# Altium project Charger Board.PrjPcb (part 2 of 3)

## Sheet uController.SchDoc
size A3
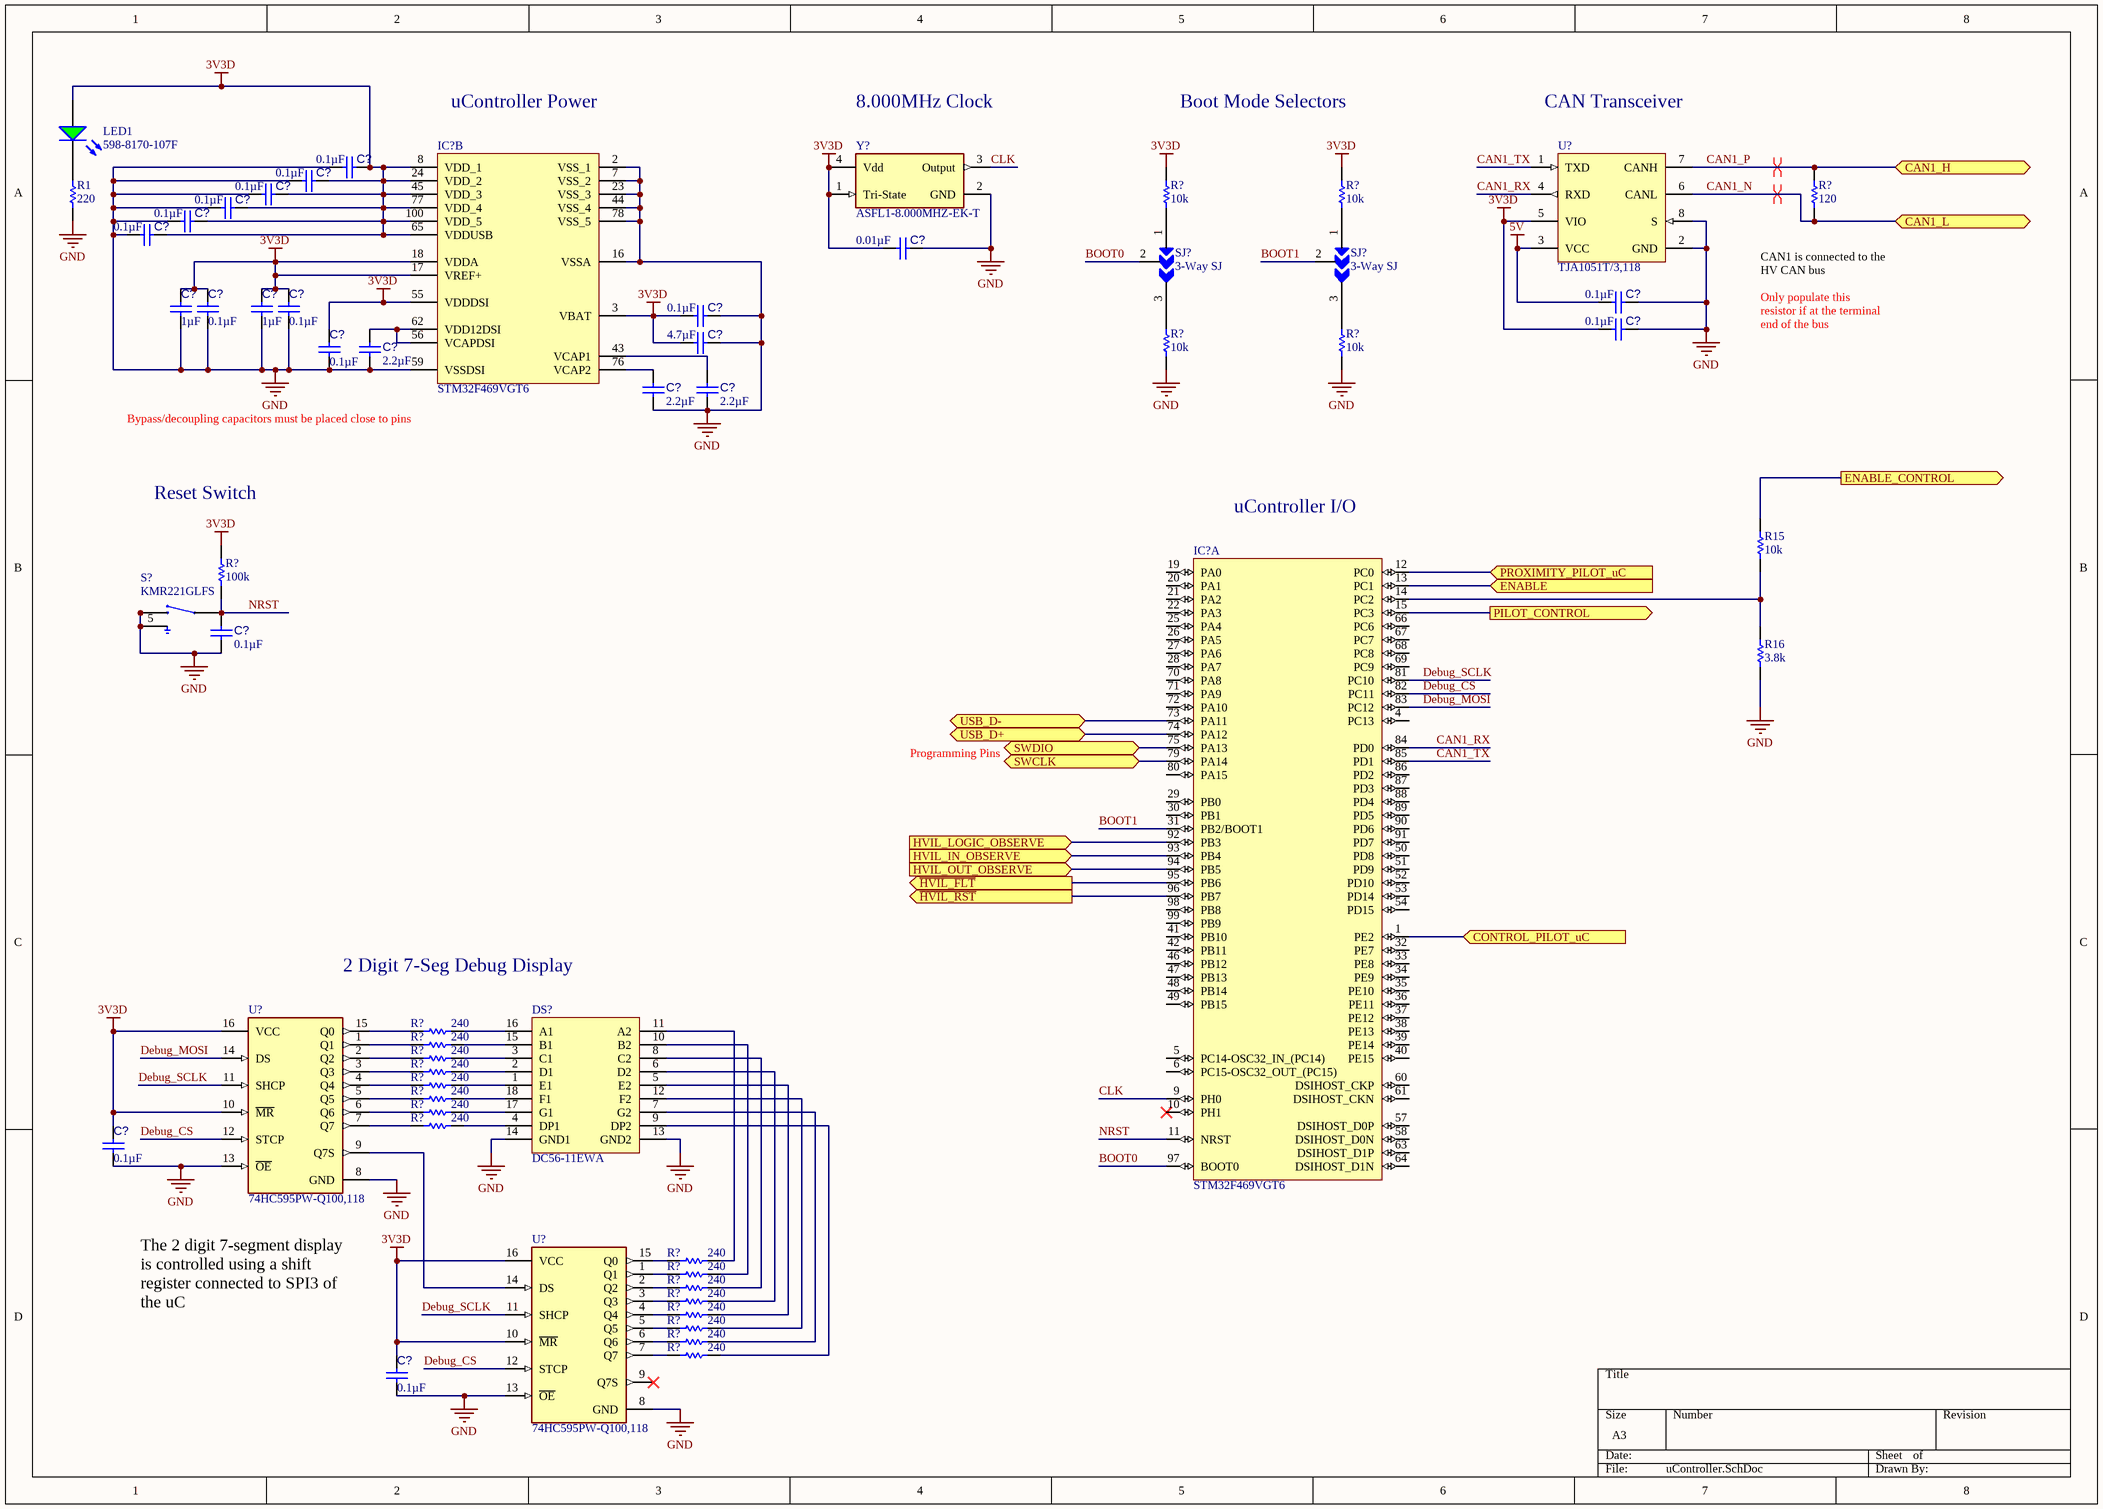
[diagram p2: uController.SchDoc]

### Parts
(Parts that share a designator on the sheet are numbered #1, #2 ... from top to bottom, then left to right.)
C?#3  0.1µF  [CAPC2013X145X50ML20T25]
C?#4  0.1µF  [CAPC2013X145X50ML20T25]
C?#5  0.1µF  [CAPC2013X145X50ML20T25]
C?#6  0.1µF  [CAPC2013X145X50ML20T25]
C?#7  0.1µF  [CAPC2013X145X50ML20T25]
C?#8  0.1µF  [CAPC2013X145X50ML20T25]
C?#9  0.01µF  [CAPC2013X145X50ML20T25]
C?#10  0.1µF  [CAPC2013X145X50ML20T25]
C?#11  0.1µF  [CAPC2013X145X50ML20T25]
C?#12  0.1µF  [CAPC2013X145X50ML20T25]
C?#13  0.1µF  [CAPC2013X145X50ML20T25]
C?#14  1µF  [CAPC2013X145X50ML20T25]
C?#15  1µF  [CAPC2013X145X50ML20T25]
C?#16  0.1µF  [CAPC2013X145X50ML20T25]
C?#17  0.1µF  [CAPC2013X145X50ML20T25]
C?#18  4.7µF  [CAPC2013X145X50ML20T25]
C?#19  2.2µF  [CAPC2013X145X50ML20T25]
C?#20  2.2µF  [CAPC2013X145X50ML20T25]
C?#21  2.2µF  [CAPC2013X145X50ML20T25]
C?#22  0.1µF  [CAPC2013X145X50ML20T25]
C?#23  0.1µF  [CAPC2013X145X50ML20T25]
C?#24  0.1µF  [CAPC2013X145X50ML20T25]
DS?#2  DC56-11EWA  [DIPS1524W75P254L2500H825Q18N]
IC?#1  STM32F469VGT6  [QFP50P1600X1600X160-100N]  (part B of 2)
IC?#2  STM32F469VGT6  [QFP50P1600X1600X160-100N]  (part A of 2)
LED1  598-8170-107F  [0805_A]
R1  220  [RESC2013X50X35ML15T15]
R15  10k  [RESC2013X50X35ML15T15]
R16  3.8k  [RESC2013X50X35ML15T15]
R?#5  10k  [RESC2013X50X35ML15T15]
R?#6  10k  [RESC2013X50X35ML15T15]
R?#7  120  [RESC2013X50X35ML15T15]
R?#8  10k  [RESC2013X50X35ML15T15]
R?#9  10k  [RESC2013X50X35ML15T15]
R?#10  100k  [RESC2013X50X35ML15T15]
R?#11  240  [RESC2013X50X35ML15T15]
R?#12  240  [RESC2013X50X35ML15T15]
R?#13  240  [RESC2013X50X35ML15T15]
R?#14  240  [RESC2013X50X35ML15T15]
R?#15  240  [RESC2013X50X35ML15T15]
R?#16  240  [RESC2013X50X35ML15T15]
R?#17  240  [RESC2013X50X35ML15T15]
R?#18  240  [RESC2013X50X35ML15T15]
R?#19  240  [RESC2013X50X35ML15T15]
R?#20  240  [RESC2013X50X35ML15T15]
R?#21  240  [RESC2013X50X35ML15T15]
R?#22  240  [RESC2013X50X35ML15T15]
R?#23  240  [RESC2013X50X35ML15T15]
R?#24  240  [RESC2013X50X35ML15T15]
R?#25  240  [RESC2013X50X35ML15T15]
R?#26  240  [RESC2013X50X35ML15T15]
S?  KMR221GLFS  [SW_KMR221GLFS]
SJ?#2  3-Way SJ  [3-Way SJ]
SJ?#3  3-Way SJ  [3-Way SJ]
U?#1  TJA1051T/3,118  [NXP-SOIC-8_L]
U?#2  74HC595PW-Q100,118  [FP-SOT403-1-MFG]
U?#3  74HC595PW-Q100,118  [FP-SOT403-1-MFG]
Y?  ASFL1-8.000MHZ-EK-T  [FP-ASFL1-MFG]

### Ports
CAN1_H (bidir), CAN1_L (bidir), CONTROL_PILOT_uC (in), ENABLE (in), ENABLE_CONTROL (out), HVIL_IN_OBSERVE (in), HVIL_LOGIC_OBSERVE (in), HVIL_OUT_OBSERVE (in), PILOT_CONTROL (out), PROXIMITY_PILOT_uC (in), SWCLK (bidir), SWDIO (bidir), USB_D+ (bidir), USB_D- (bidir), ~{HVIL_FLT} (out), ~{HVIL_RST} (out)

### Nets
3V3D: C?#3.2 C?#4.2 C?#5.2 C?#6.2 C?#7.2 C?#8.2 C?#9.1 C?#10.1 C?#11.1 C?#13.1 C?#14.2 C?#15.2 C?#16.1 C?#17.1 C?#18.1 C?#23.1 C?#24.1 IC?#1.3(VBAT) IC?#1.8(VDD_1) IC?#1.17(VREF+) IC?#1.18(VDDA) IC?#1.24(VDD_2) IC?#1.45(VDD_3) IC?#1.55(VDDDSI) IC?#1.65(VDDUSB) IC?#1.77(VDD_4) IC?#1.100(VDD_5) LED1.2(A) R?#5.2 R?#6.2 R?#10.2 U?#1.5(VIO) U?#2.10(~{MR}) U?#2.16(VCC) U?#3.10(~{MR}) U?#3.16(VCC) Y?.1(Tri-State) Y?.4(Vdd)
5V: C?#12.1 U?#1.3(VCC)
GND: C?#3.1 C?#4.1 C?#5.1 C?#6.1 C?#7.1 C?#8.1 C?#9.2 C?#10.2 C?#11.2 C?#12.2 C?#13.2 C?#14.1 C?#15.1 C?#16.2 C?#17.2 C?#18.2 C?#19.1 C?#20.1 C?#21.1 C?#22.1 C?#23.2 C?#24.2 DS?#2.13(GND2) DS?#2.14(GND1) IC?#1.2(VSS_1) IC?#1.7(VSS_2) IC?#1.16(VSSA) IC?#1.23(VSS_3) IC?#1.44(VSS_4) IC?#1.59(VSSDSI) IC?#1.78(VSS_5) R1.2 R16.1 R?#8.1 R?#9.1 S?.2 S?.3 S?.5 U?#1.2(GND) U?#1.8(S) U?#2.8(GND) U?#2.13(~{OE}) U?#3.8(GND) U?#3.13(~{OE}) Y?.2(GND)
BOOT0: IC?#2.97(BOOT0) SJ?#2.2
BOOT1: IC?#2.31(PB2/BOOT1) SJ?#3.2
CAN1_N: R?#7.1 U?#1.6(CANL) ; port CAN1_L
CAN1_P: R?#7.2 U?#1.7(CANH) ; port CAN1_H
CAN1_RX: IC?#2.84(PD0) U?#1.4(RXD)
CAN1_TX: IC?#2.85(PD1) U?#1.1(TXD)
CLK: IC?#2.9(PH0) Y?.3(Output)
Debug_CS: IC?#2.82(PC11) U?#2.12(STCP) U?#3.12(STCP)
Debug_MOSI: IC?#2.83(PC12) U?#2.14(DS)
Debug_SCLK: IC?#2.81(PC10) U?#2.11(SHCP) U?#3.11(SHCP)
NRST: C?#22.2 IC?#2.11(NRST) R?#10.1 S?.1 S?.4
NetC?#19_2: C?#19.2 IC?#1.56(VCAPDSI) IC?#1.62(VDD12DSI)
NetC?#20_2: C?#20.2 IC?#1.76(VCAP2)
NetC?#21_2: C?#21.2 IC?#1.43(VCAP1)
NetDS?#2_1: DS?#2.1(E1) R?#15.1
NetDS?#2_2: DS?#2.2(D1) R?#14.1
NetDS?#2_3: DS?#2.3(C1) R?#13.1
NetDS?#2_4: DS?#2.4(DP1) R?#18.1
NetDS?#2_5: DS?#2.5(E2) R?#23.1
NetDS?#2_6: DS?#2.6(D2) R?#22.1
NetDS?#2_7: DS?#2.7(G2) R?#25.1
NetDS?#2_8: DS?#2.8(C2) R?#21.1
NetDS?#2_9: DS?#2.9(DP2) R?#26.1
NetDS?#2_10: DS?#2.10(B2) R?#20.1
NetDS?#2_11: DS?#2.11(A2) R?#19.1
NetDS?#2_12: DS?#2.12(F2) R?#24.1
NetDS?#2_15: DS?#2.15(B1) R?#12.1
NetDS?#2_16: DS?#2.16(A1) R?#11.1
NetDS?#2_17: DS?#2.17(G1) R?#17.1
NetDS?#2_18: DS?#2.18(F1) R?#16.1
NetIC?#2_1: IC?#2.1(PE2) ; port CONTROL_PILOT_uC
NetIC?#2_12: IC?#2.12(PC0) ; port PROXIMITY_PILOT_uC
NetIC?#2_13: IC?#2.13(PC1) ; port ENABLE
NetIC?#2_14: IC?#2.14(PC2) R15.1 R16.2
NetIC?#2_15: IC?#2.15(PC3) ; port PILOT_CONTROL
NetIC?#2_73: IC?#2.73(PA11) ; port USB_D-
NetIC?#2_74: IC?#2.74(PA12) ; port USB_D+
NetIC?#2_75: IC?#2.75(PA13) ; port SWDIO
NetIC?#2_79: IC?#2.79(PA14) ; port SWCLK
NetIC?#2_92: IC?#2.92(PB3) ; port HVIL_LOGIC_OBSERVE
NetIC?#2_93: IC?#2.93(PB4) ; port HVIL_IN_OBSERVE
NetIC?#2_94: IC?#2.94(PB5) ; port HVIL_OUT_OBSERVE
NetIC?#2_95: IC?#2.95(PB6) ; port ~{HVIL_FLT}
NetIC?#2_96: IC?#2.96(PB7) ; port ~{HVIL_RST}
NetLED1_1: LED1.1(K) R1.1
NetR5_1: R15.2 ; port ENABLE_CONTROL
NetR?#5_1: R?#5.1 SJ?#2.1
NetR?#6_1: R?#6.1 SJ?#3.1
NetR?#8_2: R?#8.2 SJ?#2.3
NetR?#9_2: R?#9.2 SJ?#3.3
NetR?#11_2: R?#11.2 U?#2.15(Q0)
NetR?#12_2: R?#12.2 U?#2.1(Q1)
NetR?#13_2: R?#13.2 U?#2.2(Q2)
NetR?#14_2: R?#14.2 U?#2.3(Q3)
NetR?#15_2: R?#15.2 U?#2.4(Q4)
NetR?#16_2: R?#16.2 U?#2.5(Q5)
NetR?#17_2: R?#17.2 U?#2.6(Q6)
NetR?#18_2: R?#18.2 U?#2.7(Q7)
NetR?#19_2: R?#19.2 U?#3.15(Q0)
NetR?#20_2: R?#20.2 U?#3.1(Q1)
NetR?#21_2: R?#21.2 U?#3.2(Q2)
NetR?#22_2: R?#22.2 U?#3.3(Q3)
NetR?#23_2: R?#23.2 U?#3.4(Q4)
NetR?#24_2: R?#24.2 U?#3.5(Q5)
NetR?#25_2: R?#25.2 U?#3.6(Q6)
NetR?#26_2: R?#26.2 U?#3.7(Q7)
NetU?#2_9: U?#2.9(Q7S) U?#3.14(DS)

Not connected (* = marked no-connect by the designer): IC?#2 4(PC13) 5(PC14-OSC32_IN_(PC14)) 6(PC15-OSC32_OUT_(PC15)) 10(PH1)* 19(PA0) 20(PA1) 21(PA2) 22(PA3) 25(PA4) 26(PA5) 27(PA6) 28(PA7) 29(PB0) 30(PB1) 32(PE7) 33(PE8) 34(PE9) 35(PE10) 36(PE11) 37(PE12) 38(PE13) 39(PE14) 40(PE15) 41(PB10) 42(PB11) 46(PB12) 47(PB13) 48(PB14) 49(PB15) 50(PD8) 51(PD9) 52(PD10) 53(PD14) 54(PD15) 57(DSIHOST_D0P) 58(DSIHOST_D0N) 60(DSIHOST_CKP) 61(DSIHOST_CKN) 63(DSIHOST_D1P) 64(DSIHOST_D1N) 66(PC6) 67(PC7) 68(PC8) 69(PC9) 70(PA8) 71(PA9) 72(PA10) 80(PA15) 86(PD2) 87(PD3) 88(PD4) 89(PD5) 90(PD6) 91(PD7) 98(PB8) 99(PB9); U?#3 9(Q7S)*

### Layout directives
differential pair: CAN1_N, CAN1_P

### Notes on the sheet
- uController Power
- 8.000MHz Clock
- Boot Mode Selectors
- CAN Transceiver
- (near R?#7) CAN1 is connected to the HV CAN bus
- Only populate this resistor if at the terminal end of the bus
- Bypass/decoupling capacitors must be placed close to pins
- Reset Switch
- uController I/O
- Programming Pins
- 2 Digit 7-Seg Debug Display
- The 2 digit 7-segment display is controlled using a shift register connected to SPI3 of the uC

### Library data of the parts
C?#3-C?#8 C?#10-C?#13 C?#16 C?#17 C?#22-C?#24 = CMP-001-00010-4: Chip Capacitor, 0.1 uF, +/-10%, 25 V, 0805 (2012 Metric); Manufacturer: KEMET; Manufacturer Part Number: C0805C104K3RACTU; Dielectric Material: Ceramic; Tolerance: 10%; Capacitance: 100nF; Dielectric: X7R; Voltage: 25V; Value: 0.1µF; Supplier 1: Digi-Key; Supplier Part Number 1: 399-1168-1-ND; RoHS: Yes; Category: Ceramic Capacitors; Stock 1: 417116; Pricing 1: 1=0.14000, 10=0.10000, 50=0.05660, 100=0.04680, 500=0.03284, 1000=0.02719 (USD); Mount: Surface Mount; Case/Package: 0805; Min Operating Temperature: -55°C; Max Operating Temperature: 125°C; Packaging: Tape and Reel; Termination: SMD/SMT; Length: 2mm; Height: 0.9mm; Depth: 1.25mm; Radiation Hardening: No; ComponentLink1URL: https://datasheet.ciiva.com/18193/getdatasheetpartid-385649-18193413.pdf?src-supplier=Verical; ComponentLink1Description: https://datasheet.ciiva.com/18193/getdatasheetpartid-385649-18193413.pdf?src-supplier=Verical; ComponentLink2URL: https://datasheet.ciiva.com/7842/kem-c1002-x7r-smd-7842536.pdf?src-supplier=Element14; ComponentLink2Description: https://datasheet.ciiva.com/7842/kem-c1002-x7r-smd-7842536.pdf?src-supplier=Element14; ComponentLink3URL: https://datasheet.ciiva.com/7842/kem-c1002-x7r-smd-7842538.pdf?src-supplier=Element14; ComponentLink3Description: https://datasheet.ciiva.com/7842/kem-c1002-x7r-smd-7842538.pdf?src-supplier=Element14
C?#9 = CMP-001-00010-4: Chip Capacitor, 0.01 uF, +/-10%, 25 V, 0805 (2012 Metric); Manufacturer: KEMET; Manufacturer Part Number: C0805C103K3RACTU; Dielectric Material: Ceramic; Capacitance: 10nF; Voltage Rating: 25V; Tolerance: 10%; Dielectric: X7R; Dissipation Factor: 3.5%; Value: 0.01µF; Supplier 1: Digi-Key; Supplier Part Number 1: 399-7994-1-ND; RoHS: Yes; Category: Ceramic Capacitors; Stock 1: 50651; Pricing 1: 1=0.15000, 10=0.11000, 50=0.06220, 100=0.05160, 500=0.03616, 1000=0.02994 (USD); Mount: Surface Mount; Case/Package: 0805; Case Code (Metric): 2012; Case Code (Imperial): 0805; Min Operating Temperature: -55°C; Max Operating Temperature: 125°C; Package Quantity: 1; Packaging: Tape and Reel; Voltage Rating (DC): 25V; Termination: SMD/SMT; Length: 2mm; Height: 0.78mm; Lead Pitch: 0.75mm; Width: 0.049inch; Thickness: 0.035inch; Depth: 1.25mm; Radiation Hardening: No; REACH SVHC: No SVHC; ComponentLink1URL: http://www.jameco.com/Jameco/Products/ProdDS/1637716.pdf?src-supplier=Jameco; ComponentLink1Description: http://www.jameco.com/Jameco/Products/ProdDS/1637716.pdf?src-supplier=Jameco; ComponentLink2URL: http://www.farnell.com/datasheets/2746089.pdf?src-supplier=Farnell; ComponentLink2Description: http://www.farnell.com/datasheets/2746089.pdf?src-supplier=Farnell; ComponentLink3URL: https://www.verical.com/server-webapp/html/getDatasheet?partID=697850&src-supplier=Verical; ComponentLink3Description: https://www.verical.com/server-webapp/html/getDatasheet?partID=697850&src-supplier=Verical; ComponentLink4URL: http://components.arrow.com/part/dataview/0323_00325063?src-supplier=Arrow+Europe; ComponentLink4Description: http://components.arrow.com/part/dataview/0323_00325063?src-supplier=Arrow+Europe; ComponentLink5URL: http://www.farnell.com/datasheets/2315422.pdf?src-supplier=Farnell; ComponentLink5Description: http://www.farnell.com/datasheets/2315422.pdf?src-supplier=Farnell; ComponentLink6URL: http://www.mouser.com/ds/2/212/KEM_C1002_X7R_SMD-1102033.pdf?src-supplier=Mouser; ComponentLink6Description: http://www.mouser.com/ds/2/212/KEM_C1002_X7R_SMD-1102033.pdf?src-supplier=Mouser; ComponentLink7URL: http://components.arrow.com/part/dataview/2091057S98063N7429?src-supplier=Arrow+Electronics; ComponentLink7Description: http://components.arrow.com/part/dataview/2091057S98063N7429?src-supplier=Arrow+Electronics; ComponentLink8URL: https://api.kemet.com/component-edge/download/datasheet/C0805C103K3RACTU.pdf?src-supplier=Digi-Key; ComponentLink8Description: https://api.kemet.com/component-edge/download/datasheet/C0805C103K3RACTU.pdf?src-supplier=Digi-Key; ComponentLink9URL: http://capacitoredge.kemet.com/capedge2/DataSheet?pn=C0805C103K3RACTU&src-supplier=Avnet; ComponentLink9Description: http://capacitoredge.kemet.com/capedge2/DataSheet?pn=C0805C103K3RACTU&src-supplier=Avnet; ComponentLink10URL: https://search.kemet.com/component-edge/download/datasheet/C0805C103K3RACTU.pdf?src-supplier=Digi-Key; ComponentLink10Description: https://search.kemet.com/component-edge/download/datasheet/C0805C103K3RACTU.pdf?src-supplier=Digi-Key; ComponentLink11URL: http://www.farnell.com/datasheets/2746089.pdf?src-supplier=Newark; ComponentLink11Description: http://www.farnell.com/datasheets/2746089.pdf?src-supplier=Newark; ComponentLink12URL: http://www.farnell.com/datasheets/2064982.pdf?src-supplier=Element14; ComponentLink12Description: http://www.farnell.com/datasheets/2064982.pdf?src-supplier=Element14
C?#14 C?#15 = CMP-001-00010-4: Chip Capacitor, 1 uF, +/-10%, 25 V, 0805 (2012 Metric); Manufacturer: KEMET; Manufacturer Part Number: C0805C105K3RACTU; Dielectric Material: Ceramic; Capacitance: 1uF; Tolerance: 10%; Dielectric: X7R; Voltage: 25V; Value: 1µF; Supplier 1: Digi-Key; Supplier Part Number 1: 399-8004-1-ND; RoHS: Yes; Category: Ceramic Capacitors; Stock 1: 360844; Pricing 1: 1=0.14000, 10=0.10100, 50=0.05720, 100=0.04740, 500=0.03322, 1000=0.02750 (USD); Mount: Surface Mount; Case/Package: 0805; Number of Pins: 2; Contact Plating: Tin,Matte; Case Code (Imperial): 0805; Case Code (Metric): 2012; Min Operating Temperature: -55°C; Max Operating Temperature: 125°C; Packaging: Tape and Reel; Termination: SMD/SMT; Package Quantity: 1; Voltage Rating: 25V; Voltage Rating (DC): 25V; Length: 2mm; Height: 1.25mm; Depth: 1.25mm; Width: 0.049inch; Thickness: 0.055inch; Radiation Hardening: No; REACH SVHC: No SVHC; ComponentLink1URL: https://datasheet.ciiva.com/6074/kem-c1002-x7r-smd-6074661.pdf?src-supplier=Farnell; ComponentLink1Description: https://datasheet.ciiva.com/6074/kem-c1002-x7r-smd-6074661.pdf?src-supplier=Farnell; ComponentLink2URL: https://datasheet.ciiva.com/28610/1918693-28610874.pdf?src-supplier=Element14; ComponentLink2Description: https://datasheet.ciiva.com/28610/1918693-28610874.pdf?src-supplier=Element14
C?#18 = CMP-001-00010-4: Chip Capacitor, 4.7 uF, +/-10%, 25 V, 0805 (2012 Metric); Manufacturer: KEMET; Manufacturer Part Number: C0805C475K3PACTU; Dielectric Material: Ceramic; Capacitance: 4.7uF; Tolerance: 10%; Dielectric: X5R; Voltage: 25V; Value: 4.7µF; Supplier 1: Digi-Key; Supplier Part Number 1: 399-5505-1-ND; RoHS: Yes; Category: Ceramic Capacitors; Stock 1: 643803; Pricing 1: 1=0.33000, 10=0.22700, 50=0.15880, 100=0.13610, 500=0.10210, 1000=0.08621 (USD); Mount: Surface Mount; Case/Package: 0805; Number of Pins: 2; Min Operating Temperature: -55°C; Max Operating Temperature: 85°C; Packaging: Tape and Reel; Termination: SMD/SMT; Voltage Rating (DC): 25V; Length: 2mm; Height: 1.25mm; Depth: 1.25mm; Radiation Hardening: No; Lead Free: Lead Free; ComponentLink1URL: https://datasheet.ciiva.com/22748/1918694-22748309.pdf?src-supplier=Element14; ComponentLink1Description: https://datasheet.ciiva.com/22748/1918694-22748309.pdf?src-supplier=Element14; ComponentLink2URL: https://datasheet.ciiva.com/7842/40889-7842614.pdf?src-supplier=Element14; ComponentLink2Description: https://datasheet.ciiva.com/7842/40889-7842614.pdf?src-supplier=Element14; ComponentLink3URL: https://datasheet.ciiva.com/18193/getdatasheetpartid-385757-18193895.pdf?src-supplier=Verical; ComponentLink3Description: https://datasheet.ciiva.com/18193/getdatasheetpartid-385757-18193895.pdf?src-supplier=Verical; ComponentLink4URL: https://datasheet.ciiva.com/18193/getdatasheetpartid-195812-18193898.pdf?src-supplier=Verical; ComponentLink4Description: https://datasheet.ciiva.com/18193/getdatasheetpartid-195812-18193898.pdf?src-supplier=Verical
C?#19-C?#21 = CMP-001-00010-4: Chip Capacitor, 2.2 uF, +/-10%, 25 V, 0805 (2012 Metric); Manufacturer: KEMET; Manufacturer Part Number: C0805C225K3RACTU; Dielectric Material: Ceramic; Capacitance: 2.2uF; Tolerance: 10%; Dielectric: X7R; Voltage Rating (DC): 25V; Value: 2.2µF; Supplier 1: Digi-Key; Supplier Part Number 1: 399-11941-1-ND; RoHS: Yes; Category: Ceramic Capacitors; Stock 1: 55952; Pricing 1: 1=0.28000, 10=0.19300, 50=0.11600, 100=0.09790, 500=0.06700, 1000=0.05928 (USD); Mount: Surface Mount; Case/Package: 0805; Case Code (Imperial): 0805; Case Code (Metric): 2012; Min Operating Temperature: -55°C; Max Operating Temperature: 125°C; Packaging: Cut Tape; Voltage: 25V; Termination: Solder; Dissipation Factor: 10%; Voltage Rating: 25V; Length: 0.079inch; Height: 1.25mm; Depth: 1.25mm; Width: 0.049inch; Thickness: 0.055inch; REACH SVHC: No SVHC; ComponentLink1URL: http://www.mouser.com/ds/2/212/KEM_C1002_X7R_SMD-1102033.pdf?src-supplier=Mouser; ComponentLink1Description: http://www.mouser.com/ds/2/212/KEM_C1002_X7R_SMD-1102033.pdf?src-supplier=Mouser; ComponentLink2URL: http://www.farnell.com/datasheets/2741187.pdf?src-supplier=Farnell; ComponentLink2Description: http://www.farnell.com/datasheets/2741187.pdf?src-supplier=Farnell; ComponentLink3URL: http://www.alliedelec.com/m/d/51f554c3dd800f51434b811e71a34895.pdf?src-supplier=Allied+Electronics; ComponentLink3Description: http://www.alliedelec.com/m/d/51f554c3dd800f51434b811e71a34895.pdf?src-supplier=Allied+Electronics; ComponentLink4URL: http://www.kemet.com/docfinder?Partnumber=C0805C225K3RAC7800&src-supplier=Digi-Key; ComponentLink4Description: http://www.kemet.com/docfinder?Partnumber=C0805C225K3RAC7800&src-supplier=Digi-Key; ComponentLink5URL: http://www.kemet.com/Lists/ProductCatalog/Attachments/53/KEM_C1002_X7R_SMD.pdf?src-supplier=Avnet; ComponentLink5Description: http://www.kemet.com/Lists/ProductCatalog/Attachments/53/KEM_C1002_X7R_SMD.pdf?src-supplier=Avnet; ComponentLink6URL: https://api.kemet.com/component-edge/download/datasheet/C0805C225K3RAC7800.pdf?src-supplier=Digi-Key; ComponentLink6Description: https://api.kemet.com/component-edge/download/datasheet/C0805C225K3RAC7800.pdf?src-supplier=Digi-Key; ComponentLink7URL: http://www.farnell.com/datasheets/2112056.pdf?src-supplier=Element14; ComponentLink7Description: http://www.farnell.com/datasheets/2112056.pdf?src-supplier=Element14; ComponentLink8URL: http://www.farnell.com/datasheets/2741187.pdf?src-supplier=Newark; ComponentLink8Description: http://www.farnell.com/datasheets/2741187.pdf?src-supplier=Newark
DS?#2 = DC56-11EWA: Display; Manufacturer_Name: Kingbright; Datasheet Link: http://www.us.kingbright.com/images/catalog/SPEC/DC56-11EWA.pdf; Height: 8.25mm; Manufacturer_Part_Number: DC56-11EWA; Arrow Part Number: DC56-11EWA; Arrow Price/Stock: https://www.arrow.com/en/products/dc56-11ewa/kingbright; Mouser Part Number: 604-DC56-11EWA; Mouser Price/Stock: https://www.mouser.co.uk/ProductDetail/Kingbright/DC56-11EWA?qs=SO8VdE%2FgosGvL%2FnJcFkMow%3D%3D
IC?#1 IC?#2 = STM32F469VGT6: Integrated Circuit; Manufacturer_Name: STMicroelectronics; Datasheet Link: http://www.mouser.com/datasheet/2/389/stm32f469ae-956306.pdf; Height: 1.6mm; Manufacturer_Part_Number: STM32F469VGT6; Arrow Part Number: STM32F469VGT6; Arrow Price/Stock: https://www.arrow.com/en/products/stm32f469vgt6/stmicroelectronics; Mouser Part Number: 511-STM32F469VGT6; Mouser Price/Stock: https://www.mouser.co.uk/ProductDetail/STMicroelectronics/STM32F469VGT6?qs=o7IDWEFmXKBnYVpbRx%2F38g%3D%3D
LED1 = CMP-2000-05655-1: Single Color, 2 V, -30 to 85 degC, 2-Pin SMD (0805), RoHS, Tape and Reel; Manufacturer: Dialight; Main Category: ChipLED; Shape Type: Rectangular; Forward Current: 25mA; Product Length (mm): 2mm; Emitting Color: YellowGreen; Test Current (It): 20mA; Number of  Elements: 1; Luminous Intensity: 20mcd; DELETED: Compliant; Reverse Voltage: 5V; Chip Material: GaP; High Brightness: No; Viewing Angle: 140deg; Dominant Wave Length: 570nm; Type: Uni-Color; Product Depth (mm): 1.25mm; Power Dissipation: 60W; Product Height (mm): 0.7mm; Forward Voltage: 2.4V; Lens Dimensions: 1.4x1.25x0.4mm; Pin Count: 2; Datasheet URL: https://datasheet.ciiva.com/22748/1484480-22748121.pdf; Operating Temperature Classification: Commercial; Package Reference: 0805; Operating Temp Range: -30Cto85C; Mounting: SurfaceMount; Mounting Technology: SurfaceMount; Manufacturer URL: http://www.dialight.com/; Package Description: 2-Pin Surface Mount Device, Body 2 x 1.25 mm; Lum Intensity: 20mcd; Datasheet Version: 10/2008; Rad Hardened: No; Packaging: TapeandReel; Package Type: SMD
R1 = CMP-009-00001-4: as R?#1 on sheet PartsTemplate; Value: 220
R15 R16 R?#5 R?#6 R?#8 R?#9 = CMP-009-00001-4: Chip Resistor, 10k Ohm, +/- 1%, 125 mW, -55 to 155 degC, 0805 (2012 Metric); Manufacturer: Yageo; Manufacturer Part Number: RC0805FR-0710KL; Resistance: 10kR; Temperature Coefficient: 100ppm/°C; Power Rating: 125mW; Voltage Rating: 150V; Supplier 1: Digi-Key; Supplier Part Number 1: 311-10.0KCRCT-ND; RoHS: Yes; Category: Chip SMD Resistors; Stock 1: 19063106; Pricing 1: 1=0.10000, 10=0.03900, 100=0.01570, 1000=0.00705, 2500=0.00612 (USD); Case/Package: 0805; Case Code (Imperial): 0805; Case Code (Metric): 2012; Min Operating Temperature: -55°C; Max Operating Temperature: 155°C; Packaging: Tape and Reel; Tolerance: 1%; Composition: Thick Film; Package Quantity: 1; Termination: SMD/SMT; Number of Terminations: 2; Military Standard: Not; Max Power Dissipation: 125mW; Features: Moisture Resistant; Length: 2mm; Height: 0.024inch; Width: 0.049inch; Depth: 1.25mm; REACH SVHC: Unknown; Lead Free: Lead Free; ComponentLink1URL: https://datasheet.ciiva.com/11808/0900766b8106beab-11808151.pdf?src-supplier=RSComponents; ComponentLink1Description: https://datasheet.ciiva.com/11808/0900766b8106beab-11808151.pdf?src-supplier=RSComponents; ComponentLink2URL: https://datasheet.ciiva.com/12669/rc0805-12669688.pdf?src-supplier=Mouser; ComponentLink2Description: https://datasheet.ciiva.com/12669/rc0805-12669688.pdf?src-supplier=Mouser; ComponentLink3URL: https://datasheet.ciiva.com/46447/444164-46447563.pdf?src-supplier=Element14; ComponentLink3Description: https://datasheet.ciiva.com/46447/444164-46447563.pdf?src-supplier=Element14; ComponentLink4URL: https://datasheet.ciiva.com/2456/pyu-r-int-thick-7-2456972.pdf?src-supplier=Digi-Key; ComponentLink4Description: https://datasheet.ciiva.com/2456/pyu-r-int-thick-7-2456972.pdf?src-supplier=Digi-Key; ComponentLink5URL: https://datasheet.ciiva.com/2456/pyu-r-int-thick-7-2456973.pdf?src-supplier=Digi-Key; ComponentLink5Description: https://datasheet.ciiva.com/2456/pyu-r-int-thick-7-2456973.pdf?src-supplier=Digi-Key; ComponentLink6URL: https://datasheet.ciiva.com/2456/pyu-r-int-thick-7-2456974.pdf?src-supplier=Digi-Key; ComponentLink6Description: https://datasheet.ciiva.com/2456/pyu-r-int-thick-7-2456974.pdf?src-supplier=Digi-Key; ComponentLink7URL: https://datasheet.ciiva.com/16747/rc0805-16747087.pdf?src-supplier=Future+Electronics; ComponentLink7Description: https://datasheet.ciiva.com/16747/rc0805-16747087.pdf?src-supplier=Future+Electronics
  R15 R?#5 R?#6 R?#8 R?#9: Value: 10k
  R16: Value: 3.8k
R?#7 = CMP-009-00001-4: Chip Resistor, 120 Ohm, +/- 1%, 125 mW, -55 to 155 degC, 0805 (2012 Metric); Manufacturer: TE Connectivity; Manufacturer Part Number: CRGCQ0805F120R; Resistance: 120R; Max Power Dissipation: 125mW; Temperature Coefficient: 100ppm/°C; Value: 120; Supplier 1: Digi-Key; Supplier Part Number 1: A129738CT-ND; Stock 1: 52253; Pricing 1: 1=0.10000, 10=0.04700, 100=0.01890, 1000=0.00851, 2500=0.00738 (USD); Case/Package: 0805; Case Code (Imperial): 0805; Case Code (Metric): 2012; Min Operating Temperature: -55°C; Max Operating Temperature: 155°C; Composition: Thick Film; Features: Moisture Resistant; Packaging: Tape and Reel; Tolerance: 1%; Number of Terminations: 2; ComponentLink1URL: https://www.te.com/commerce/DocumentDelivery/DDEController?Action=srchrtrv&amp;DocNm=1773204-3&amp;DocType=DS&amp;DocLang=English&src-supplier=Digi-Key; ComponentLink1Description: https://www.te.com/commerce/DocumentDelivery/DDEController?Action=srchrtrv&amp;DocNm=1773204-3&amp;DocType=DS&amp;DocLang=English&src-supplier=Digi-Key; ComponentLink2URL: https://4donline.ihs.com/images/VipMasterIC/IC/TYEL/TYEL-S-A0004929575/TYEL-S-A0004929575-1.pdf?hkey=52A5661711E402568146F3353EA87419&src-supplier=Element14; ComponentLink2Description: https://4donline.ihs.com/images/VipMasterIC/IC/TYEL/TYEL-S-A0004929575/TYEL-S-A0004929575-1.pdf?hkey=52A5661711E402568146F3353EA87419&src-supplier=Element14; ComponentLink3URL: https://4donline.ihs.com/images/VipMasterIC/IC/TYEL/TYEL-S-A0004929575/TYEL-S-A0004929575-1.pdf?hkey=52A5661711E402568146F3353EA87419&src-supplier=Newark; ComponentLink3Description: https://4donline.ihs.com/images/VipMasterIC/IC/TYEL/TYEL-S-A0004929575/TYEL-S-A0004929575-1.pdf?hkey=52A5661711E402568146F3353EA87419&src-supplier=Newark; ComponentLink4URL: https://4donline.ihs.com/images/VipMasterIC/IC/TYEL/TYEL-S-A0004929575/TYEL-S-A0004929575-1.pdf?hkey=52A5661711E402568146F3353EA87419&src-supplier=Farnell; ComponentLink4Description: https://4donline.ihs.com/images/VipMasterIC/IC/TYEL/TYEL-S-A0004929575/TYEL-S-A0004929575-1.pdf?hkey=52A5661711E402568146F3353EA87419&src-supplier=Farnell; ComponentLink5URL: http://datasheet.octopart.com/CRGCQ0805F120R-TE-Connectivity-datasheet-114679081.pdf?src-supplier=Master+Electronics; ComponentLink5Description: http://datasheet.octopart.com/CRGCQ0805F120R-TE-Connectivity-datasheet-114679081.pdf?src-supplier=Master+Electronics; ComponentLink6URL: http://sigma.octopart.com/114695583/technical_drawing/TE-Connectivity-CRGCQ0805F120R.pdf?src-supplier=Sager+Electronics; ComponentLink6Description: http://sigma.octopart.com/114695583/technical_drawing/TE-Connectivity-CRGCQ0805F120R.pdf?src-supplier=Sager+Electronics
R?#10 = CMP-009-00001-4: Chip Resistor, 100k Ohm, +/- 1%, 125 mW, -55 to 155 degC, 0805 (2012 Metric); Manufacturer: Yageo; Manufacturer Part Number: RC0805FR-07100KL; Resistance: 100kR; Voltage Rating (DC): 150V; Temperature Coefficient: 100ppm/°C; Power Rating: 125mW; Value: 100k; Supplier 1: Digi-Key; Supplier Part Number 1: 311-100KCRCT-ND; RoHS: Yes; Category: Chip SMD Resistors; Stock 1: 3716407; Pricing 1: 1=0.10000, 10=0.03900, 100=0.01570, 1000=0.00705, 2500=0.00612 (USD); Case/Package: 0805; Number of Pins: 2; Case Code (Metric): 2012; Case Code (Imperial): 0805; Min Operating Temperature: -55°C; Max Operating Temperature: 155°C; Tolerance: 1%; Packaging: Tape and Reel; Composition: Thick Film; Voltage Rating: 150V; Package Quantity: 1; Number of Terminations: 2; Termination: SMD/SMT; Military Standard: Not; Max Power Dissipation: 125mW; Features: Moisture Resistant; Length: 2mm; Height: 0.024inch; Width: 0.049inch; Depth: 1.25mm; Lead Pitch: 0.4mm; REACH SVHC: Unknown; Lead Free: Lead Free; ComponentLink1URL: https://datasheet.ciiva.com/11808/0900766b8106beab-11808858.pdf?src-supplier=RSComponents; ComponentLink1Description: https://datasheet.ciiva.com/11808/0900766b8106beab-11808858.pdf?src-supplier=RSComponents; ComponentLink2URL: https://datasheet.ciiva.com/2457/pyu-r-int-thick-7-2457017.pdf?src-supplier=Digi-Key; ComponentLink2Description: https://datasheet.ciiva.com/2457/pyu-r-int-thick-7-2457017.pdf?src-supplier=Digi-Key; ComponentLink3URL: https://datasheet.ciiva.com/12667/rc0805-12667001.pdf?src-supplier=Mouser; ComponentLink3Description: https://datasheet.ciiva.com/12667/rc0805-12667001.pdf?src-supplier=Mouser; ComponentLink4URL: https://datasheet.ciiva.com/2457/pyu-r-int-thick-7-2457018.pdf?src-supplier=Digi-Key; ComponentLink4Description: https://datasheet.ciiva.com/2457/pyu-r-int-thick-7-2457018.pdf?src-supplier=Digi-Key; ComponentLink5URL: https://datasheet.ciiva.com/16747/rc0805-16747226.pdf?src-supplier=Future+Electronics; ComponentLink5Description: https://datasheet.ciiva.com/16747/rc0805-16747226.pdf?src-supplier=Future+Electronics; ComponentLink6URL: https://datasheet.ciiva.com/2457/pyu-r-int-thick-7-2457019.pdf?src-supplier=Digi-Key; ComponentLink6Description: https://datasheet.ciiva.com/2457/pyu-r-int-thick-7-2457019.pdf?src-supplier=Digi-Key; ComponentLink7URL: https://datasheet.ciiva.com/7660/38627-7660796.pdf?src-supplier=Element14; ComponentLink7Description: https://datasheet.ciiva.com/7660/38627-7660796.pdf?src-supplier=Element14; ComponentLink8URL: https://datasheet.ciiva.com/7941/1697719-7941676.pdf?src-supplier=Element14; ComponentLink8Description: https://datasheet.ciiva.com/7941/1697719-7941676.pdf?src-supplier=Element14; ComponentLink9URL: https://datasheet.ciiva.com/7941/1686128-7941677.pdf?src-supplier=Element14; ComponentLink9Description: https://datasheet.ciiva.com/7941/1686128-7941677.pdf?src-supplier=Element14; ComponentLink10URL: https://datasheet.ciiva.com/7941/1697719-7941678.pdf?src-supplier=Element14; ComponentLink10Description: https://datasheet.ciiva.com/7941/1697719-7941678.pdf?src-supplier=Element14; ComponentLink11URL: https://datasheet.ciiva.com/22747/444164-22747534.pdf?src-supplier=Element14; ComponentLink11Description: https://datasheet.ciiva.com/22747/444164-22747534.pdf?src-supplier=Element14
R?#11-R?#26 = CMP-009-00001-4: Chip Resistor, 240 Ohm, +/- 1%, 125 mW, -55 to 155 degC, 0805 (2012 Metric); Manufacturer: Panasonic; Manufacturer Part Number: ERA-6AEB241V; Resistance: 240R; Power Rating: 125mW; Tolerance: 0.1%; Voltage Rating: 100V; Temperature Coefficient: 25ppm/°C; Value: 240; Supplier 1: Digi-Key; Supplier Part Number 1: P240DACT-ND; RoHS: Yes; Category: Chip SMD Resistors; Stock 1: 12724; Pricing 1: 1=0.33000, 10=0.27800, 100=0.10850, 1000=0.04541, 2500=0.04163 (USD); Mount: Surface Mount; Case/Package: 0805; Number of Pins: 2; Case Code (Metric): 2012; Case Code (Imperial): 0805; Contact Plating: Tin; Min Operating Temperature: -55°C; Max Operating Temperature: 155°C; Packaging: Tape and Reel; Package Quantity: 1; Composition: Thin Film; Number of Terminations: 2; Military Standard: Not; Termination: Solder; Max Power Dissipation: 125mW; Voltage Rating (DC): 100V; Features: Automotive AEC-Q200; Length: 2mm; Height: 0.5mm; Width: 1.25mm; Depth: 1.25mm; Radiation Hardening: No; REACH SVHC: No SVHC; Lead Free: Lead Free; ComponentLink1URL: https://datasheet.ciiva.com/29184/452815-da-01-en-widerstand-0805-era-29184072.pdf?src-supplier=Conrad; ComponentLink1Description: https://datasheet.ciiva.com/29184/452815-da-01-en-widerstand-0805-era-29184072.pdf?src-supplier=Conrad; ComponentLink2URL: https://datasheet.ciiva.com/5915/485442-5915205.pdf?src-supplier=Farnell; ComponentLink2Description: https://datasheet.ciiva.com/5915/485442-5915205.pdf?src-supplier=Farnell; ComponentLink3URL: https://datasheet.ciiva.com/43455/485442-43455397.pdf?src-supplier=Farnell; ComponentLink3Description: https://datasheet.ciiva.com/43455/485442-43455397.pdf?src-supplier=Farnell; ComponentLink4URL: https://datasheet.ciiva.com/30154/54aoa0000ce26-30154486.pdf?src-supplier=Onlinecomponents.com; ComponentLink4Description: https://datasheet.ciiva.com/30154/54aoa0000ce26-30154486.pdf?src-supplier=Onlinecomponents.com; ComponentLink5URL: https://datasheet.ciiva.com/48425/era-eng-tds-48425782.pdf?src-supplier=Distrelec; ComponentLink5Description: https://datasheet.ciiva.com/48425/era-eng-tds-48425782.pdf?src-supplier=Distrelec; ComponentLink6URL: https://datasheet.ciiva.com/5915/485442-5915208.pdf?src-supplier=Farnell; ComponentLink6Description: https://datasheet.ciiva.com/5915/485442-5915208.pdf?src-supplier=Farnell; ComponentLink7URL: https://datasheet.ciiva.com/46389/485442-46389960.pdf?src-supplier=Element14; ComponentLink7Description: https://datasheet.ciiva.com/46389/485442-46389960.pdf?src-supplier=Element14; ComponentLink8URL: https://datasheet.ciiva.com/46389/485442-46389961.pdf?src-supplier=Element14; ComponentLink8Description: https://datasheet.ciiva.com/46389/485442-46389961.pdf?src-supplier=Element14; ComponentLink9URL: https://datasheet.ciiva.com/48536/era-eng-tds-48536634.pdf?src-supplier=Distrelec; ComponentLink9Description: https://datasheet.ciiva.com/48536/era-eng-tds-48536634.pdf?src-supplier=Distrelec; ComponentLink10URL: https://datasheet.ciiva.com/22739/485442-22739483.pdf?src-supplier=Element14; ComponentLink10Description: https://datasheet.ciiva.com/22739/485442-22739483.pdf?src-supplier=Element14; ComponentLink11URL: https://datasheet.ciiva.com/17206/aoa0000ce26-17206700.pdf?src-supplier=Avnet+Europe; ComponentLink11Description: https://datasheet.ciiva.com/17206/aoa0000ce26-17206700.pdf?src-supplier=Avnet+Europe; ComponentLink12URL: https://datasheet.ciiva.com/43457/485442-43457869.pdf?src-supplier=Farnell; ComponentLink12Description: https://datasheet.ciiva.com/43457/485442-43457869.pdf?src-supplier=Farnell
S? = KMR221GLFS: Tactile Switch SPST-NO Top Actuated Surface Mount; MF: C&K; MP: KMR221GLFS; Price: None; Package: None; Value: *; Availability: Unavailable; SnapEDA_Link: https://www.snapeda.com/parts/KMR221GLFS/C%26K/view-part/347724/?ref=snap
SJ?#2 SJ?#3 = 3-Way SJ: 3-Way Solder Jumper
U?#1 = CMP-2000-07245-1: High-Speed CAN Transceiver, 3 to 5 V, 8-Pin SOIC (SOT96-1), RoHS, Tape and Reel; Manufacturer: NXP; Power Down Mode: Normal/Silent; Rad Hardened: No; Number of Transceivers: 1; Supply Current: 70mA; Operating Supply Voltage (Max): 5.5V; Operating Supply Voltage (Typ): 5V; Operating Supply Voltage (Min): 4.5V; Standard Supported: ISO11898-2; Data Rate: 1Mbps; DELETED: Compliant; Operating Temperature (Min): -40C; Datasheet Version: Rev. 7, 01/2015; Pin Count: 8; Operating Temperature (Max): 125C; Package Description: 8-Pin Small Outline Integrated Circuit, Body 4.9 x 3.9 mm, Pitch 1.27 mm; Category: Transceiver; Packaging: TapeandReel; Mounting: SurfaceMount; Package Reference: SOT96-1; Operating Temperature Classification: Automotive; Mounting Technology: SurfaceMount; Package Type: SO; Manufacturer URL: http://www.nxp.com/; Datasheet URL: http://www.nxp.com/documents/data_sheet/TJA1051.pdf
U?#2 U?#3 = CMP-14351-000002-1: IC SHIFT REGISTER 8BIT 16TSSOP; Manufacturer: Nexperia; Nominal Supply Current: 160uA; Max Supply Voltage: 6V; Standoff Height: 0.05mm; Automotive Grade: Grade 1; Number Of Circuits: 1; Min Supply Voltage: 2V; Frequency: 108MHz; Number Of Outputs: 9; Propagation Delay: 16ns; Ambient Temperature Range Low: -40°C; Device Class L3: Shift Registers; Device Class L2: Logic ICs; RoHS: TRUE; Footprint Url: https://assets.nexperia.com/documents/outline-drawing/SOT403-1.pdf; ComponentLink2URL: https://assets.nexperia.com/documents/data-sheet/74HC_HCT595_Q100.pdf; Digikey Description: IC SHIFT REGISTER 8BIT 16TSSOP; Manufacturer Part Number: 74HC595PW-Q100,118; Automotive: Yes; Temperature Range High: +125°C; Temperature Range Low: -40°C; Height: 1.1mm; Ambient Temperature Range High: +125°C; Package: SOT403-1; ComponentLink2Description: Datasheet; Octopart: https://octopart.com/74hc595pw-q100%2C118-nexperia-78737379; Number Of Inputs: 1; Ipc Land Pattern Name: SOP65P500X110-16; Lead Free: Yes; Device Class L1: Integrated Circuits (ICs); Category: IC; Temperature: -40°C to +125°C
Y? = CMP-27762-000018-1: XTAL OSC XO 8.000MHZ HCMOS TTL; Manufacturer: Abracon; Stability: 50ppm; Min Supply Voltage: 2.97V; Max Supply Voltage: 3.63V; Load Capacitance: 15pF; Max Supply Current: 15mA; Temperature Range Low: -20°C; Temperature Range High: +70°C; Automotive: No; Device Class L3: Oscillators; Height: 1.3mm; Device Class L2: Crystals / Oscillators; Digikey Description: XTAL OSC XO 8.000MHZ HCMOS TTL; Footprint Url: https://abracon.com/Support/PackageDrawing/Oscillators/ASFL1.PDF; Manufacturer Part Number: ASFL1-8.000MHZ-EK-T; ComponentLink2URL: https://abracon.com/Oscillators/ASFL1.pdf; Mouser Description: Oscillator XO 8.000MHz 50ppm 15pF (Stability) HCMOS/TTL 60% 3.3V 4-Pin SMD T/R; Package: ASFL1; Series: ASFL1; Octopart: https://octopart.com/asfl1-16.384mhz-ec-t-abracon-317624; Category: Crys; Lead Free: Yes; RoHS: TRUE; Frequency: 8.000MHz; Temperature: -20°C to +70°C; Device Class L1: Passive Components; ComponentLink2Description: Datasheet

## Sheet Connectors.SchDoc
size A3
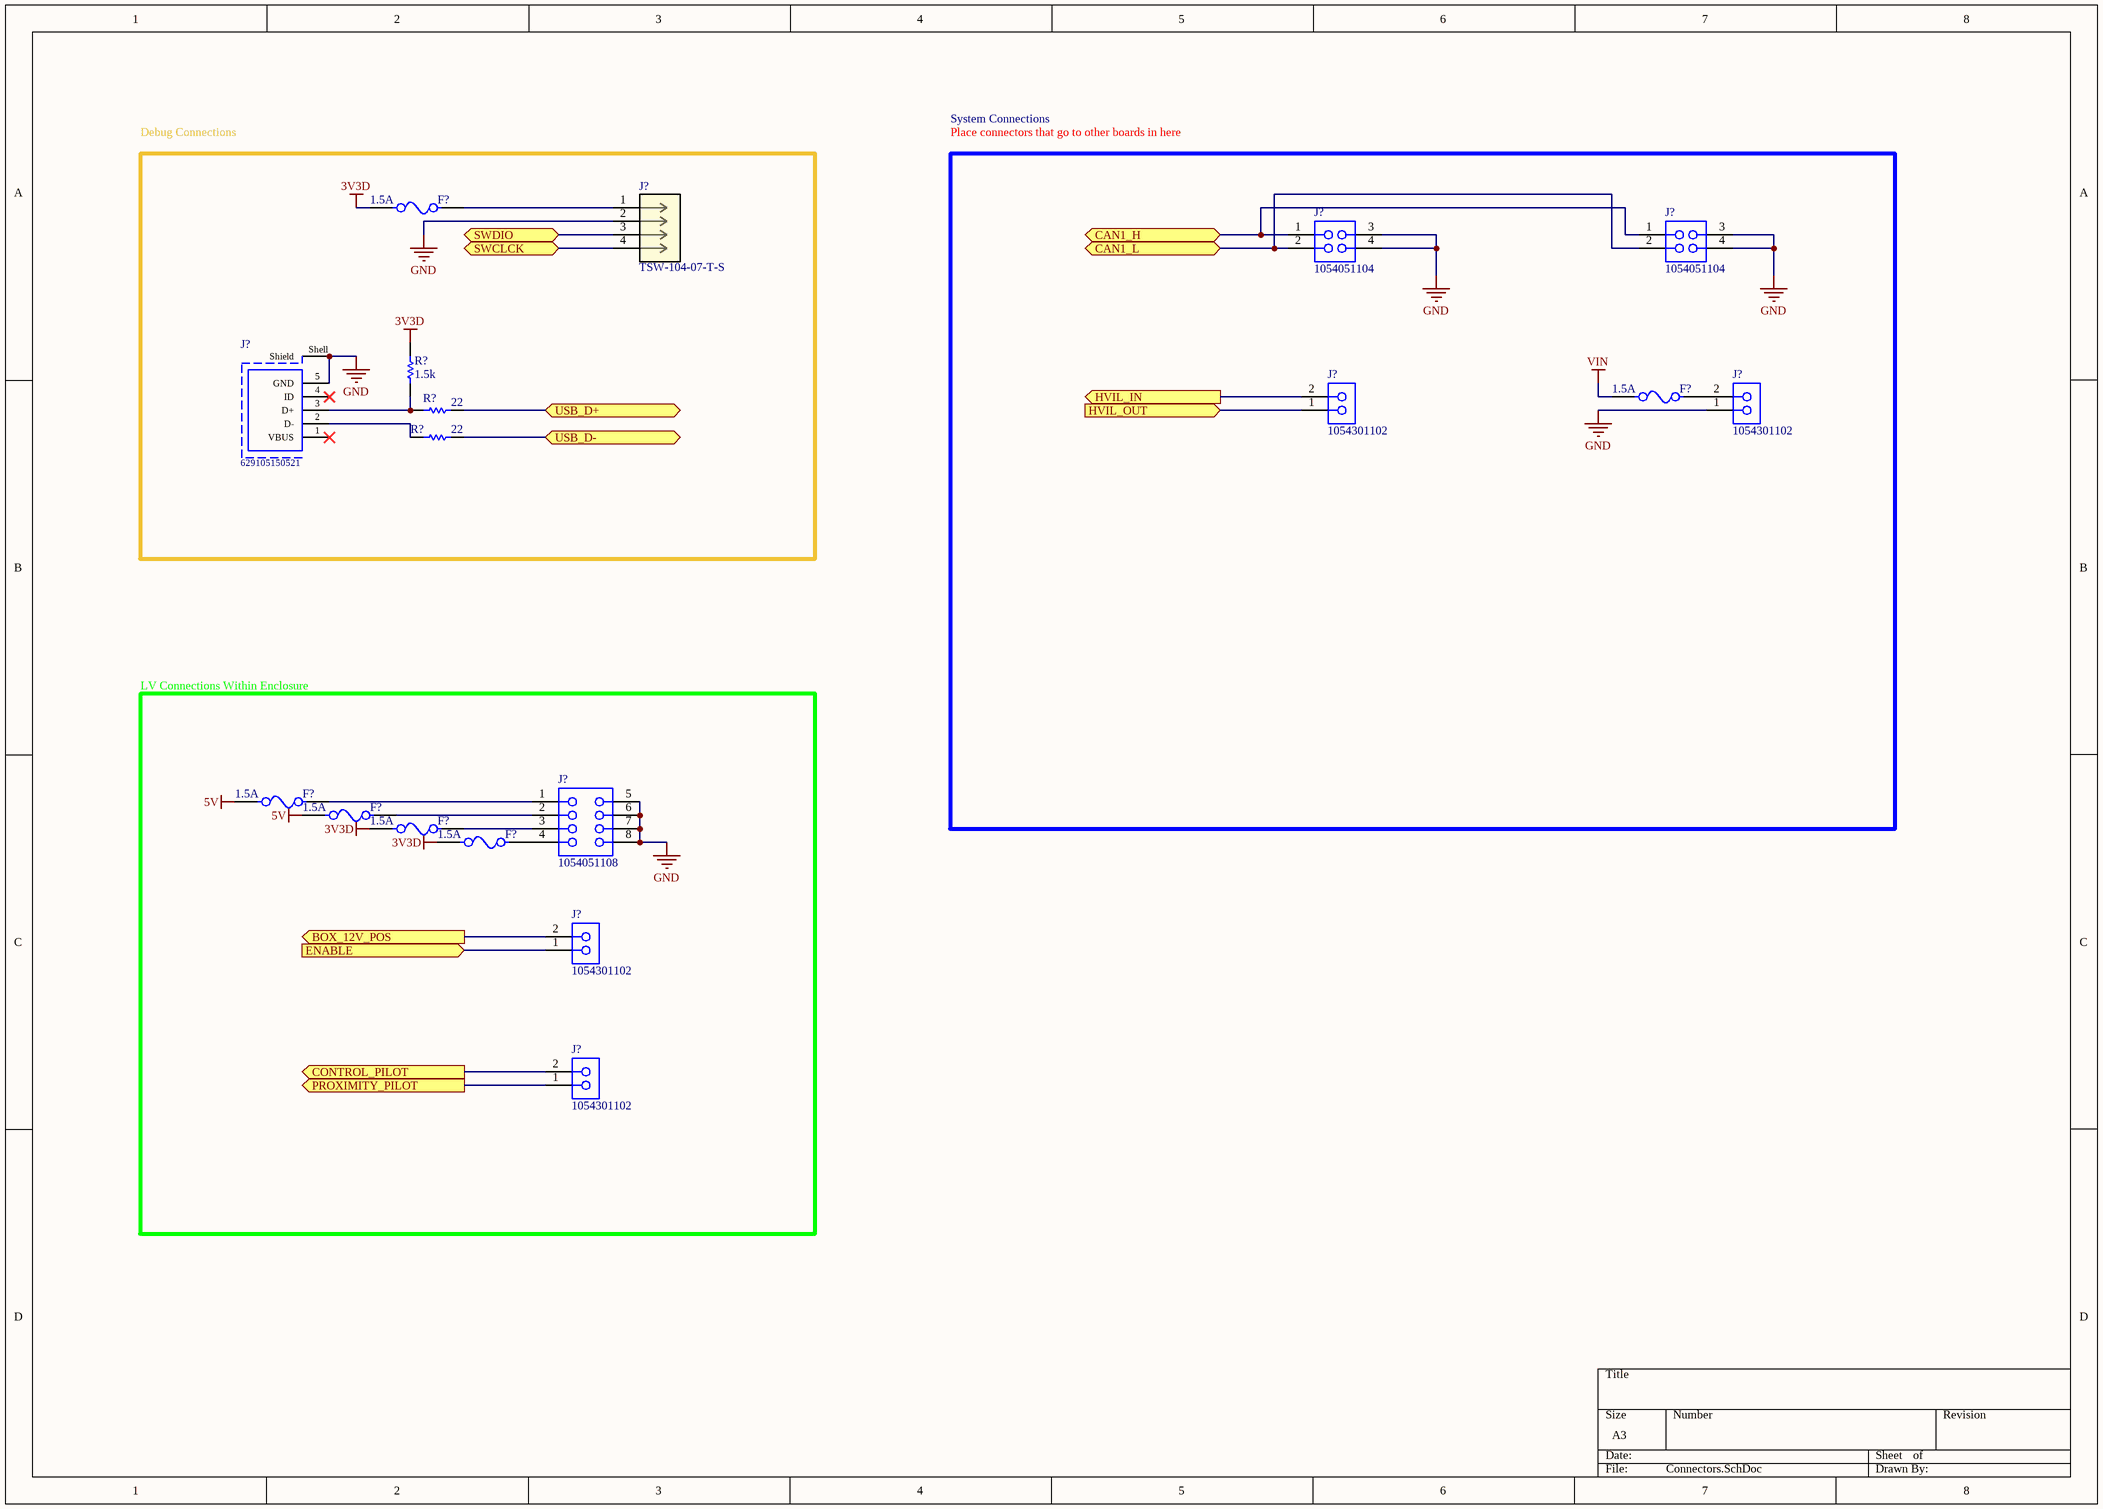
[diagram p3: Connectors.SchDoc]

### Parts
(Parts that share a designator on the sheet are numbered #1, #2 ... from top to bottom, then left to right.)
F?#2  1.5A  [FUSC1608X43N]
F?#3  1.5A  [FUSC1608X43N]
F?#4  1.5A  [FUSC1608X43N]
F?#5  1.5A  [FUSC1608X43N]
F?#6  1.5A  [FUSC1608X43N]
F?#7  1.5A  [FUSC1608X43N]
J?#5  TSW-104-07-T-S  [CON4_1X4_TU_TSW]
J?#6  1054051104  [1054051104]
J?#7  1054051104  [1054051104]
J?#8  1054301102  [1054301102]
J?#9  1054301102  [1054301102]
J?#10  629105150521  [629105150521]
J?#11  1054051108  [1054051108]
J?#12  1054301102  [1054301102]
J?#13  1054301102  [1054301102]
R?#27  1.5k  [RESC2013X50X35ML15T15]
R?#28  22  [RESC0805(2012)_L]
R?#29  22  [RESC2013X50X35ML15T15]

### Blocks framed on the sheet
Debug Connections: F?#2 J?#5 J?#10 R?#27-R?#29
Place connectors that go to other boards in here: F?#3 J?#6-J?#9
LV Connections Within Enclosure: F?#4-F?#7 J?#11-J?#13

### Ports
BOX_12V_POS (out), CAN1_H (bidir), CAN1_L (bidir), CONTROL_PILOT (out), ENABLE (in), HVIL_IN (out), HVIL_OUT (in), PROXIMITY_PILOT (out), SWCLCK (bidir), SWDIO (bidir), USB_D+ (bidir), USB_D- (bidir)

### Nets
3V3D: F?#2.1 F?#6.1 F?#7.1 R?#27.1
5V: F?#4.1 F?#5.1
GND: J?#5.2 J?#6.3 J?#6.4 J?#7.3 J?#7.4 J?#9.1 J?#10.5(GND) J?#10.Shell(Shield) J?#11.5 J?#11.6 J?#11.7 J?#11.8
VIN: F?#3.1
CAN1_N: J?#6.2 J?#7.2 ; port CAN1_L
CAN1_P: J?#6.1 J?#7.1 ; port CAN1_H
NetD1_1: J?#13.2 ; port CONTROL_PILOT
NetF?#2_2: F?#2.2 J?#5.1
NetF?#3_2: F?#3.2 J?#9.2
NetF?#4_2: F?#4.2 J?#11.1
NetF?#5_2: F?#5.2 J?#11.2
NetF?#6_2: F?#6.2 J?#11.3
NetF?#7_2: F?#7.2 J?#11.4
NetIC?#2_12: J?#13.1 ; port PROXIMITY_PILOT
NetIC?#2_13: J?#12.1 ; port ENABLE
NetIC?#2_73: R?#29.1 ; port USB_D-
NetIC?#2_74: R?#28.1 ; port USB_D+
NetIC?#2_75: J?#5.3 ; port SWDIO
NetIC?#2_79: J?#5.4 ; port SWCLCK
NetJ?#8_1: J?#8.1 ; port HVIL_OUT
NetJ?#8_2: J?#8.2 ; port HVIL_IN
NetJ?#10_2: J?#10.2(D-) R?#29.2
NetJ?#10_3: J?#10.3(D+) R?#27.2 R?#28.2
NetJ?#12_2: J?#12.2 ; port BOX_12V_POS

Not connected (* = marked no-connect by the designer): J?#10 1(VBUS)* 4(ID)*

### Notes on the sheet
- System Connections

### Library data of the parts
F?#2-F?#7 = 046701.5NR: 1.5A 0603 Fuse; Manufacturer_Name: LITTELFUSE; Datasheet Link: https://www.littelfuse.com/~/media/electronics/datasheets/fuses/littelfuse_fuse_467_datasheet.pdf.pdf; Height: 0.432mm; Manufacturer_Part_Number: 046701.5NR; Arrow Part Number: 046701.5NR; Arrow Price/Stock: https://www.arrow.com/en/products/046701.5nr/littelfuse; Mouser Part Number: 576-046701.5NR; Mouser Price/Stock: https://www.mouser.com/Search/Refine.aspx?Keyword=576-046701.5NR; Value: 1.5A
J?#5 = TSW-104-07-T-S: 4 Pin Header; Vendor: Samtec Inc; Built_By: EMA_UL_Team; Manufacturer_Part_Number: TSW-104-07-T-S; Copyright: Copyright (C) 2018 Accelerated Designs. All rights reserved; RefDes: RefDes; Type: DEV
J?#6 J?#7 = 1054051104: Nano-Fit Right-Angle Header, Surface Mount, 2.50mm Pitch, Dual Row, 4 Circuits, 0.76µm Tin (Sn) Plating, Black, Glow-Wire Capable; Manufacturer: Molex; Pitch: 2.5 mm; Part Number: 1054051104; ComponentLink2Description: Datasheet; Mounting Technology: Surface Mount; ComponentLink2URL: https://www.molex.com/webdocs/datasheets/pdf/en-us/1054051104_PCB_HEADERS.pdf; Orientation: Right
J?#8 J?#9 J?#12 J?#13 = 1054301102: Nano-Fit Right-Angle Header, Surface Mount, 2.50mm Pitch, Single Row, 2 Circuits, 0.76µm Tin (Sn) Plating, Black, Glow-Wire Capable; Manufacturer: Molex; Pitch: 2.5 mm; Part Number: 1054301102; ComponentLink2Description: Datasheet; Mounting Technology: Surface Mount; ComponentLink2URL: https://www.molex.com/webdocs/datasheets/pdf/en-us/1054301102_PCB_HEADERS.pdf; Orientation: Right
J?#10 = CMP-1502-03252-1: Micro USB 2.0 Type B Receptacle WR-COM, Horizontal, SMT, with Pegs, High Current at Pin 1 & Pin 5; Manufacturer: Wurth Elektronik; Contact Resistance: 30mOhm; Rated Current: 3A; Working Voltage: 30VAC; Package Reference: 629105150521; Mounting Technology: SMT; Connector Type: MicroUSB2.0TypeB; Operating Temperature: -40to85degC; Orientation: Horizontal; Manufacturer URL: http://www.we-online.de; Datasheet URL: https://katalog.we-online.de/em/datasheet/629105150521.pdf; Part Number: 629105150521; Packaging: TapeandReel; Gender: Receptacle; Publisher: WurthElektronik
J?#11 = 1054051108: Nano-Fit Right-Angle Header, Surface Mount, 2.50mm Pitch, Dual Row, 8 Circuits, 0.76µm Tin (Sn) Plating, Black, Glow-Wire Capable; Manufacturer: Molex; Part Number: 1053141108; Pitch: 2.5mm; ComponentLink2URL: https://www.molex.com/webdocs/datasheets/pdf/en-us/1054051108_PCB_HEADERS.pdf; ComponentLink2Description: Datasheet; Orientation: Right; Mounting Technology: Surface Mount
R?#27 = CMP-009-00001-4: Chip Resistor,1.5k Ohm, +/- 1%, 125 mW, -55 to 155 degC, 0805 (2012 Metric); Value: 1.5k
R?#28 = CMP-1013-00736-1: 100K 0.125W 1% 0805 (2012 Metric)  SMD; Value: 22
R?#29 = CMP-009-00001-4: Chip Resistor, 22 Ohm, +/- 1%, 125 mW, -55 to 155 degC, 0805 (2012 Metric); Value: 22